# EAGLE design MainDevice (EAGLE 9.6.2)
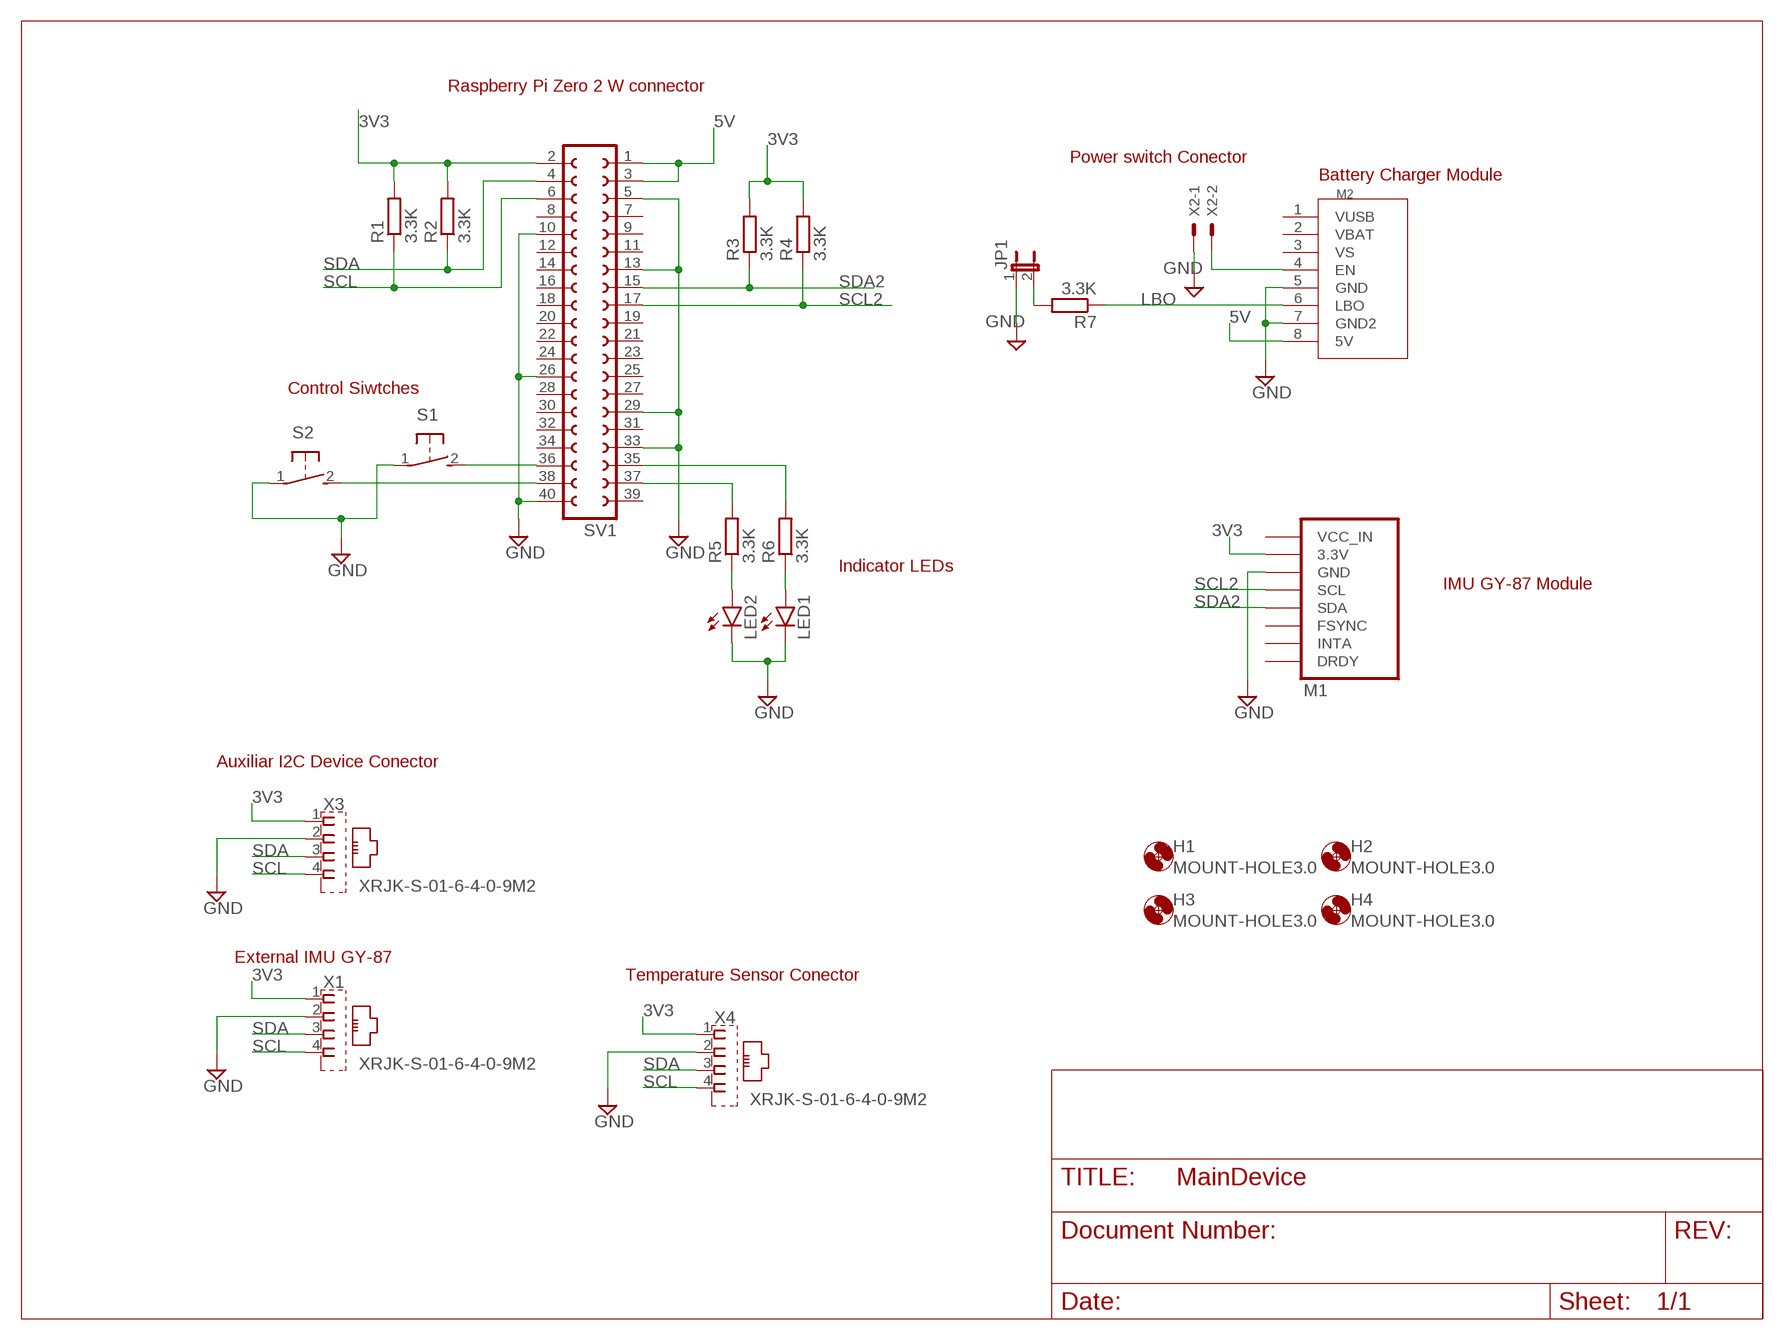
[diagram p0: schematic, sheet 1]

## Parts
H1  MOUNT-HOLE3.0  [3,0]
H2  MOUNT-HOLE3.0  [3,0]
H3  MOUNT-HOLE3.0  [3,0]
H4  MOUNT-HOLE3.0  [3,0]
JP1  JP1E  [JP1]
LED1  LED5MM  [LED5MM]
LED2  LED5MM  [LED5MM]
M1  GY-87  [GY-87]
M2  POWERBOOST_1000C  [POWERBOOST_1000C]
R1  3.3K  R-EU_R0805  [R0805]
R2  3.3K  R-EU_R0805  [R0805]
R3  3.3K  R-EU_R0805  [R0805]
R4  3.3K  R-EU_R0805  [R0805]
R5  3.3K  R-EU_R0805  [R0805]
R6  3.3K  R-EU_R0805  [R0805]
R7  3.3K  R-EU_R0805  [R0805]
S1  31-XX  [B3F-31XX]
S2  31-XX  [B3F-31XX]
SV1  FE20-2  [FE20-2]
X1  XRJK-S-01-6-4-0-9M2  [XRJK-S-01-6-4-0-9M2]
X2  22-23-2021  [22-23-2021]
X3  XRJK-S-01-6-4-0-9M2  [XRJK-S-01-6-4-0-9M2]
X4  XRJK-S-01-6-4-0-9M2  [XRJK-S-01-6-4-0-9M2]

## Nets
3V3: M1.2(3.3V) R1.2 R2.2 R3.2 R4.2 SV1.2 X1.1 X3.1 X4.1
5V: M2.8(5V) SV1.1 SV1.3
GND: JP1.1 LED1.K(C) LED2.K(C) M1.3(GND) M2.5(GND) M2.7(GND2) S1.1(P) S2.1(P) SV1.5 SV1.10 SV1.13 SV1.26 SV1.29 SV1.33 SV1.40 X1.2 X2.1 X3.2 X4.2
LBO: M2.6(LBO) R7.1
N$1: S1.2(S) SV1.36
N$2: S2.2(S) SV1.38
N$3: M2.4(EN) X2.2
N$4: LED2.A R5.1
N$5: LED1.A R6.1
N$6: JP1.2 R7.2
N$7: R6.2 SV1.35
N$8: R5.2 SV1.37
SCL: R1.1 SV1.6 X1.4 X3.4 X4.4
SCL2: M1.4(SCL) R4.1 SV1.17
SDA: R2.1 SV1.4 X1.3 X3.3 X4.3
SDA2: M1.5(SDA) R3.1 SV1.15
Unconnected: M1.1(VCC_IN) M1.6(FSYNC) M1.7(INTA) M1.8(DRDY) M2.1(VUSB) M2.2(VBAT) M2.3(VS) SV1.7 SV1.8 SV1.9 SV1.11 SV1.12 SV1.14 SV1.16 SV1.18 SV1.19 SV1.20 SV1.21 SV1.22 SV1.23 SV1.24 SV1.25 SV1.27 SV1.28 SV1.30 SV1.31 SV1.32 SV1.34 SV1.39

## Notes on the sheet
- Raspberry Pi Zero 2 W connector
- Power switch Conector
- Battery Charger Module
- Control Siwtches
- Indicator LEDs
- IMU GY-87 Module
- Auxiliar I2C Device Conector
- External IMU GY-87
- Temperature Sensor Conector

## Library data of the parts
H1-H4 = holes:MOUNT-HOLE: MOUNTING HOLE with drill center marker
JP1 = jumper:JP1E: JUMPER
LED1 LED2 = led:LED: LED OSRAM: - CHIPLED LG R971, LG N971, LY N971, LG Q971, LY Q971, LO R971, LY R971 LH N974, LH R974 LS Q976, LO Q976, LY Q976 LO Q996 - Hyper CHIPLED LW Q18S LB Q993, LB Q99A, LB R99A - SideLED LS A670, LO A670, LY A670, LG A670, LP A670 LB A673, LV A673, LT A673, LW A673 LH A674 LY A675 LS A676, LA A676, LO A676, LY A676, LW A676 LS A679, LY A679, LG A679 - Hyper Micro SIDELED® LS Y876, LA Y876, LO Y876, LY Y876 LT Y87S - SmartLED LW L88C, LW L88S LB L89C, LB L89S, LG L890 LS L89K, LO L89K, LY L89K LS L896, LA L896, LO L896, LY L896 - TOPLED LS T670, LO T670, LY T670, LG T670, LP T670 LSG T670, LSP T670, LSY T670, LOP T670, LYG T670 LG T671, LOG T671, LSG T671 LB T673, LV T673, LT T673, LW T673 LH T674 LS T676, LA T676, LO T676, LY T676, LB T676, LH T676, LSB T676, LW T676 LB T67C, LV T67C, LT T67C, LS T67K, LO T67K, LY T67K, LW E67C LS E67B, LA E67B, LO E67B, LY E67B, LB E67C, LV E67C, LT E67C LW T67C LS T679, LY T679, LG T679 LS T770, LO T770, LY T770, LG T770, LP T770 LB T773, LV T773, LT T773, LW T773 LH T774 LS E675, LA E675, LY E675, LS T675 LS T776, LA T776, LO T776, LY T776, LB T776 LHGB T686 LT T68C, LB T68C - Hyper Mini TOPLED® LB M676 - Mini TOPLED Santana® LG M470 LS M47K, LO M47K, LY M47K Source: http://www.osram.convergy.de LUXEON: - LUMILED® LXK2-PW12-R00, LXK2-PW12-S00, LXK2-PW14-U00, LXK2-PW14-V00 LXK2-PM12-R00, LXK2-PM12-S00, LXK2-PM14-U00 LXK2-PE12-Q00, LXK2-PE12-R00, LXK2-PE12-S00, LXK2-PE14-T00, LXK2-PE14-U00 LXK2-PB12-K00, LXK2-PB12-L00, LXK2-PB12-M00, LXK2-PB14-N00, LXK2-PB14-P00, LXK2-PB14-Q00 LXK2-PR12-L00, LXK2-PR12-M00, LXK2-PR14-Q00, LXK2-PR14-R00 LXK2-PD12-Q00, LXK2-PD12-R00, LXK2-PD12-S00 LXK2-PH12-R00, LXK2-PH12-S00 LXK2-PL12-P00, LXK2-PL12-Q00, LXK2-PL12-R00 Source: www.luxeon.com KINGBRIGHT: KA-3528ASYC Source: www.kingbright.com
M1 = pechera:GY-87: FEMALE HEADER; OC_FARNELL: unknown; OC_NEWARK: unknown
M2 = pechera:POWERBOOST_1000C
R1-R7 = rcl:R-EU_: RESISTOR, European symbol; SPICEPREFIX: R
S1 S2 = switch-omron:31-XX: OMRON SWITCH; MPN: B3F-3100; OC_FARNELL: 959704; OC_NEWARK: 36M3582
SV1 = con-lsta:FE20-2: FEMALE HEADER; OC_FARNELL: unknown; OC_NEWARK: unknown
X1 X3 X4 = pechera:XRJK*4: RJ11 Connector without LED, 6 position, 4 contacts, thrue hole Source: XRJK-S-01-6-4-0-9M2(01).pdf
X2 = con-molex:22-23-2021: .100" (2.54mm) Center Header - 2 Pin; MF: MOLEX; MPN: 22-23-2021; OC_FARNELL: 1462926; OC_NEWARK: 25C3832

## Board
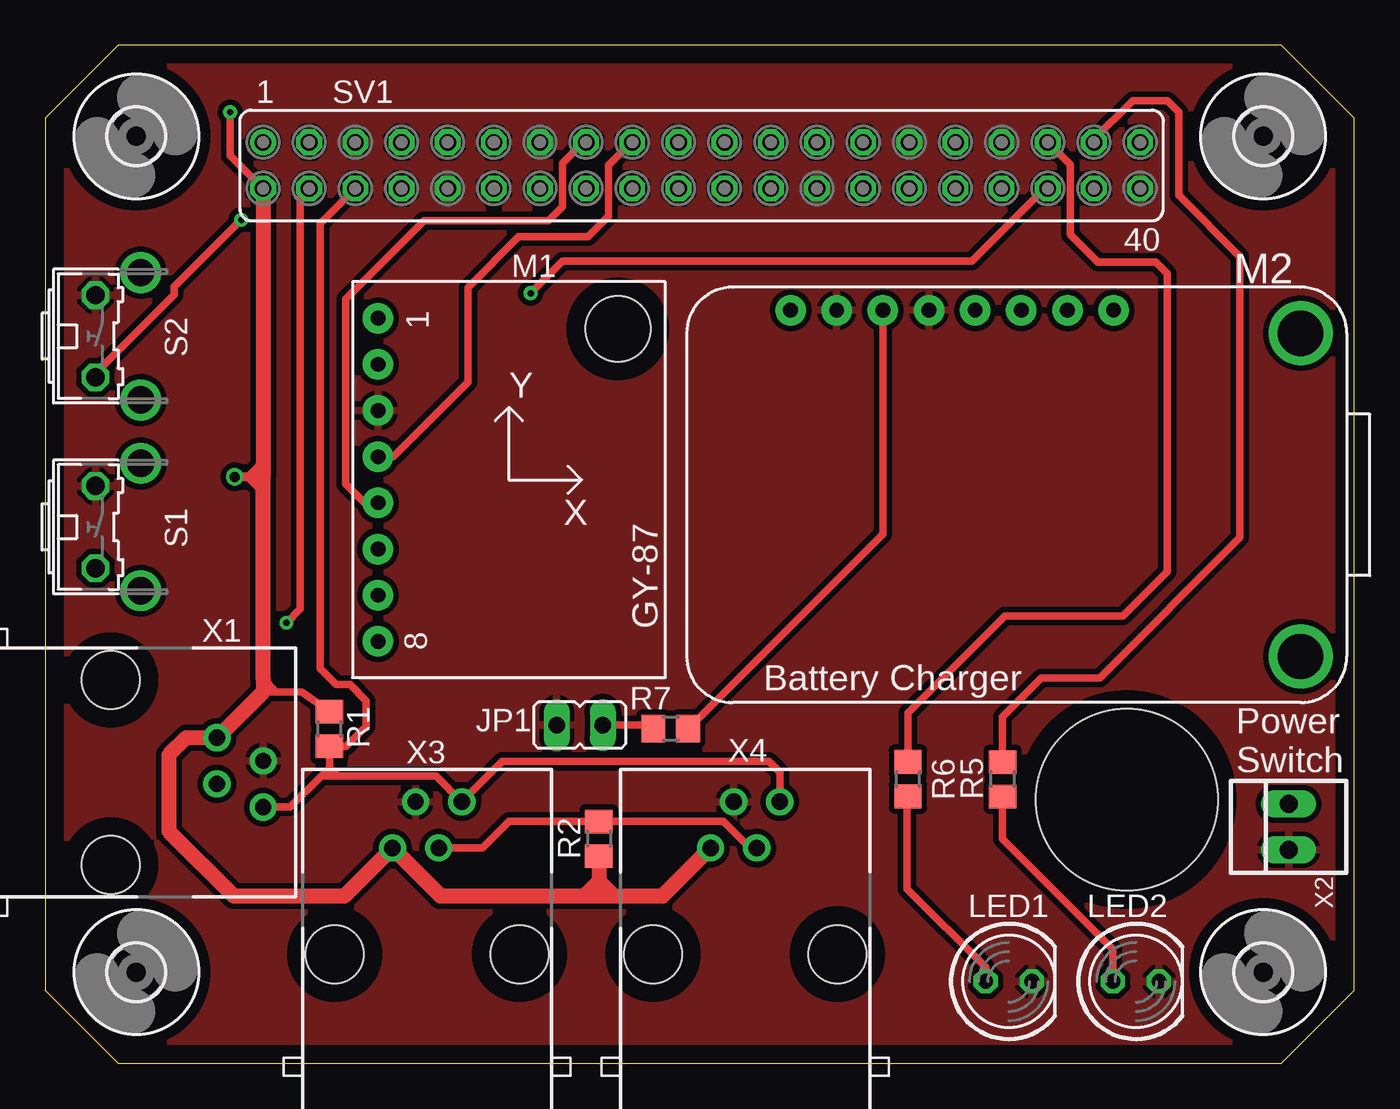
[diagram p1: board, top side]
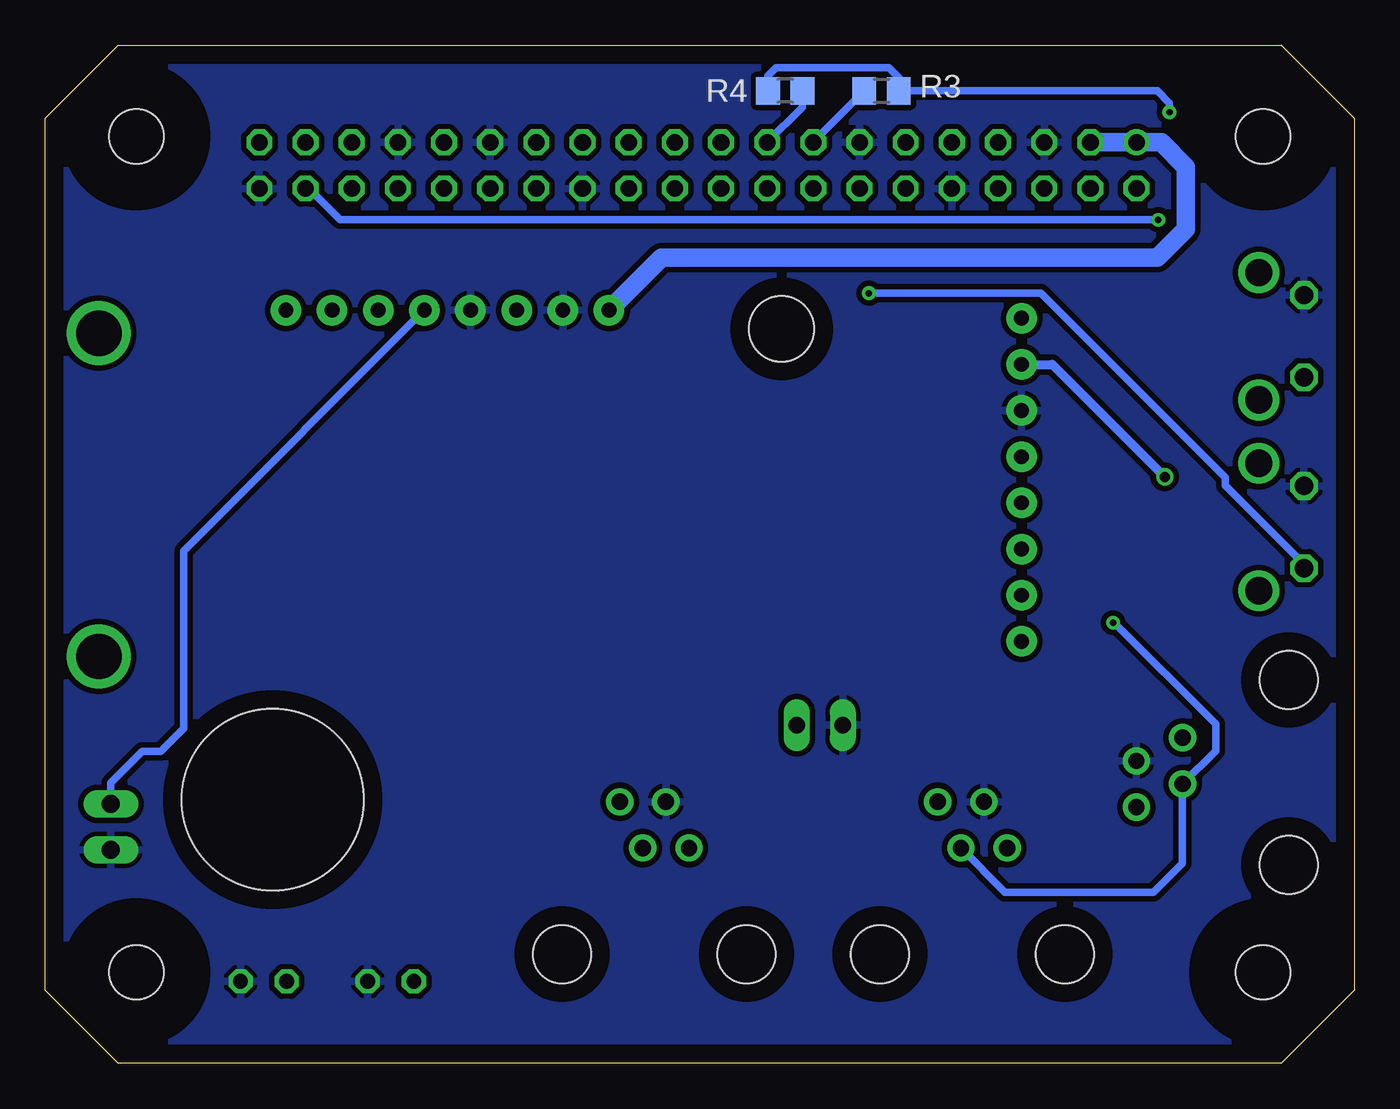
[diagram p2: board, bottom side, seen from below]

Size 72 x 56 mm. Coordinates in mm from the lower left corner, seen from the top.
Outline: 4,0 68,0 72,4 72,52 68,56 4,56 0,52 0,4 4,0
Copper layers (1*16): Top 0.035mm / dielectric 1.5mm / Bottom 0.035mm
Design rules "default *": minimum track width 12mil, minimum drill 0.35mm, track to track 12mil, track to pad 10mil, pad to pad 10mil, via to via 10mil, smd to smd 6mil, copper to edge 40mil, drill to drill 6mil, minimum pad ring 10mil, minimum via ring 8mil, stop-mask expansion 4mil, vias tented up to drill 0mil, thermal gap 10mil
Holes 10 mm at 59.5,14.5

### Footprints (pad centres in the part's own frame; a part is rotated, then mirrored left to right if it is on the bottom)
3,0 = hole 3: 0,0
JP1 = drill 0.914 long: 1 0,-1.27; 2 0,1.27
LED5MM = drill 0.813 octagon: A -1.27,0; K 1.27,0
GY-87 = drill 0.813 pad 1.676: 1 -7.2,8.89; 2 -7.2,6.35; 3 -7.2,3.81; 4 -7.2,1.27; 5 -7.2,-1.27; 6 -7.2,-3.81; 7 -7.2,-6.35; 8 -7.2,-8.89 | hole 3.6: 6,8.3
POWERBOOST_1000C = drill 0.813 pad 1.676: 1 12.827,1.27; 2 15.367,1.27; 3 17.907,1.27; 4 20.447,1.27; 5 22.987,1.27; 6 25.527,1.27; 7 28.067,1.27; 8 30.607,1.27 | drill 2.5: M1 2.54,20.32; M2 2.54,2.54
R0805 = smd 1.3 x 1.5: 1 -0.95,0; 2 0.95,0
B3F-31XX = drill 1.016 octagon: 1 -2.261,-1.245; 2 2.261,-1.245 | drill 1.499 pad 2.159: 3 -3.505,1.245; 4 3.505,1.245
FE20-2 = drill 0.914: 1 -24.13,1.27 | drill 0.914 octagon: 2 -24.13,-1.27; 3 -21.59,1.27; 4 -21.59,-1.27; 5 -19.05,1.27; 6 -19.05,-1.27; 7 -16.51,1.27; 8 -16.51,-1.27; 9 -13.97,1.27; 10 -13.97,-1.27; 11 -11.43,1.27; 12 -11.43,-1.27; 13 -8.89,1.27; 14 -8.89,-1.27; 15 -6.35,1.27; 16 -6.35,-1.27; 17 -3.81,1.27; 18 -3.81,-1.27; 19 -1.27,1.27; 20 -1.27,-1.27; 21 1.27,1.27; 22 1.27,-1.27; 23 3.81,1.27; 24 3.81,-1.27; 25 6.35,1.27; 26 6.35,-1.27; 27 8.89,1.27; 28 8.89,-1.27; 29 11.43,1.27; 30 11.43,-1.27; 31 13.97,1.27; 32 13.97,-1.27; 33 16.51,1.27; 34 16.51,-1.27; 35 19.05,1.27; 36 19.05,-1.27; 37 21.59,1.27; 38 21.59,-1.27; 39 24.13,1.27; 40 24.13,-1.27
XRJK-S-01-6-4-0-9M2 = drill 0.9 pad 1.5: 1 -1.905,5.842; 2 -0.635,8.382; 3 0.635,5.842; 4 1.905,8.382 | hole 3.2: -5.08,0; 5.08,0
22-23-2021 = drill 1 long: 1 -1.27,0; 2 1.27,0

### Placement (x,y rotation side)
H1  5,51 0 top
H2  5,5 0 top
H3  67,5 0 top
H4  67,51 0 top
JP1  29.4,18.6 270 top
LED1  53,4.5 0 top
LED2  60,4.5 0 top
M1  25.5,32.1 0 top
M2  71.6,42.7 180 top
R1  15.62,18.39 90 top
R2  30.45,12.35 270 top
R3  26,53.5 0 bottom
R4  31.3,53.5 180 bottom
R5  52.66,15.62 90 top
R6  47.46,15.63 90 top
R7  34.4,18.4 180 top
S1  4,29.5 270 top
S2  4,40 270 top
SV1  36.1,49.4 0 top
X1  3.6,16 270 top
X2  68.4,13 90 top
X3  21,6 0 top
X4  38.5,6 0 top

### Tracks (layer width: path | path; a pad name or v marks a point on that pad's centre or on a via)
3V3  (via drill 0.35, 0.55)
  Top 0.406: v10.16,52.32 10.16,49.94 SV1.2 | 11.97,20.43 12.7,20.43 | 12.7,20.43 11.97,21.16 11.97,21.21 | 12.7,20.43 14.08,20.43 R1.2
  Top 0.508: 11.97,32.26 11.18,32.26 | 11.18,32.26 v10.41,32.26 | 11.18,32.26 11.81,32.89 11.97,32.89 | 11.18,32.26 11.81,31.62 11.97,31.62
  Top 0.813: SV1.2 11.97,32.89 11.97,32.26 11.97,31.62 11.97,21.21 11.97,20.43 X1.1 7.75,17.91 6.79,16.95 6.79,12.76 10.36,9.2 16.45,9.2 X3.1 21.74,9.2 29.65,9.2 | X4.1 33.95,9.2 31.2,9.2 | 29.65,9.2 30.4,9.2 | 30.4,9.2 31.2,9.2 | R2.2 30.45,10 | 30.45,10 30.45,9.25 30.4,9.2 | 30.45,10 29.65,9.2 | 30.45,10 31.2,9.25 31.2,9.2
  Bottom 0.406: v10.16,52.32 10.16,52.83 10.83,53.5 R3.2 25.05,54.23 25.6,54.78 31.8,54.78 32.25,54.33 R4.2
  Bottom 0.508: M1.2 16.61,38.45 v10.41,32.26
5V
  Bottom 1.016: M2.8 38.1,44.32 10.83,44.32 9.25,45.9 9.25,49.31 10.61,50.67 SV1.1 SV1.3
GND
  pour Top: 0,0 0,56 72,56 72,0
  pour Bottom: 0,0 0,56 72,56 72,0
LBO
  Top 0.406: R7.1 46.07,29.12 M2.6
N$1  (via drill 0.35)
  Top 0.406: v26.7,42.37 28.45,44.12 50.98,44.12 54.86,48.01 55.09,48.01 SV1.36
  Bottom 0.406: v26.7,42.37 17.22,42.37 7.09,32.23 7.09,31.77 2.74,27.43 2.74,27.25 S1.2
N$2  (via drill 0.35)
  Top 0.406: v10.77,46.41 7.09,42.72 7.09,42.29 2.74,37.95 2.74,37.75 S2.2
  Bottom 0.406: v10.77,46.41 55.78,46.41 57.38,48.01 57.61,48.01 SV1.38
N$3
  Bottom 0.406: M2.4 64.39,28.19 64.39,18.41 65.65,17.14 66.67,17.14 68.4,15.42 X2.2
N$4
  Top 0.406: R5.1 52.66,12.34 58.73,6.27 LED2.A
N$5
  Top 0.406: LED1.A 51.73,5.27 47.4,9.6 47.4,14.62 R6.1
N$6
  Top 0.406: JP1.2 33.25,18.6 R7.2
N$7
  Top 0.406: SV1.35 56.39,49.43 56.39,45.59 57.91,44.07 61.09,44.07 61.72,43.43 61.72,27.05 59.27,24.6 52.8,24.6 47.46,19.26 R6.2
N$8
  Top 0.305: 57.61,50.75 SV1.37
  Top 0.406: 57.61,50.75 59.82,52.96 61.72,52.96 62.36,52.32 62.36,47.75 65.72,44.39 65.72,28.92 58,21.2 54.8,21.2 52.66,19.06 R5.2
SCL
  Top 0.406: SV1.6 15.11,46.19 15.11,21.72 16,20.83 16.76,20.83 17.65,19.94 17.65,18.54 16.55,17.44 R1.1 15.62,16.26 | X1.4 13.46,14.1 15.18,15.82 | 15.18,15.82 15.62,16.26 | X4.4 40.41,15.99 39.8,16.6 25.12,16.6 X3.4 21.49,15.8 16.09,15.8 | 15.62,16.26 16.09,15.8 | 16.09,15.8 15.2,15.8 15.18,15.82
SCL2
  Top 0.406: M1.4 19.15,33.37 23.24,37.47 23.24,42.67 26.04,45.47 29.84,45.47 30.99,46.61 30.99,49.4 32.26,50.67 SV1.17
  Bottom 0.406: SV1.17 30.35,52.61 R4.1
SDA  (via drill 0.35)
  Top 0.406: v13.26,24.23 14.02,24.99 14.02,47.64 SV1.4 | X4.3 38.76,11.84 37.3,13.3 R2.1 25.5,13.3 24.04,11.84 X3.3
  Bottom 0.406: v13.26,24.23 13.18,24.23 7.62,18.67 7.62,17.19 X1.3 9.44,11.01 11.05,9.4 19.2,9.4 X3.3
SDA2
  Top 0.406: M1.5 17.56,30.83 16.51,31.88 16.51,42.04 20.83,46.35 27.69,46.35 28.45,47.12 28.45,49.53 29.59,50.67 SV1.15
  Bottom 0.406: R3.1 29.75,50.7 SV1.15

### Text on the board
tPlace: GY-87 | Battery Charger | Power / Switch